# Altium schematic sheet 2012_fdp_balise_mere.SchDoc
size A2
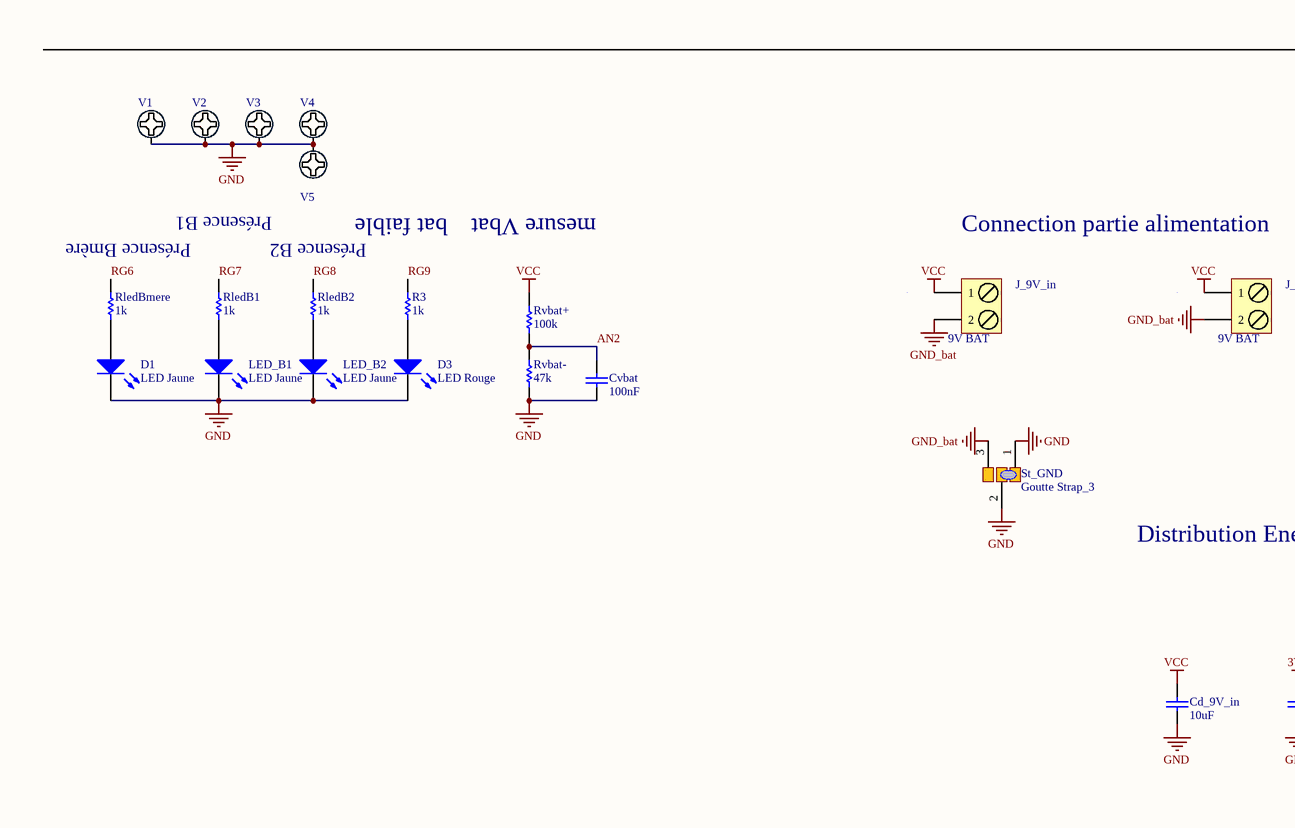
[diagram p0: 2012_fdp_balise_mere.SchDoc, left]
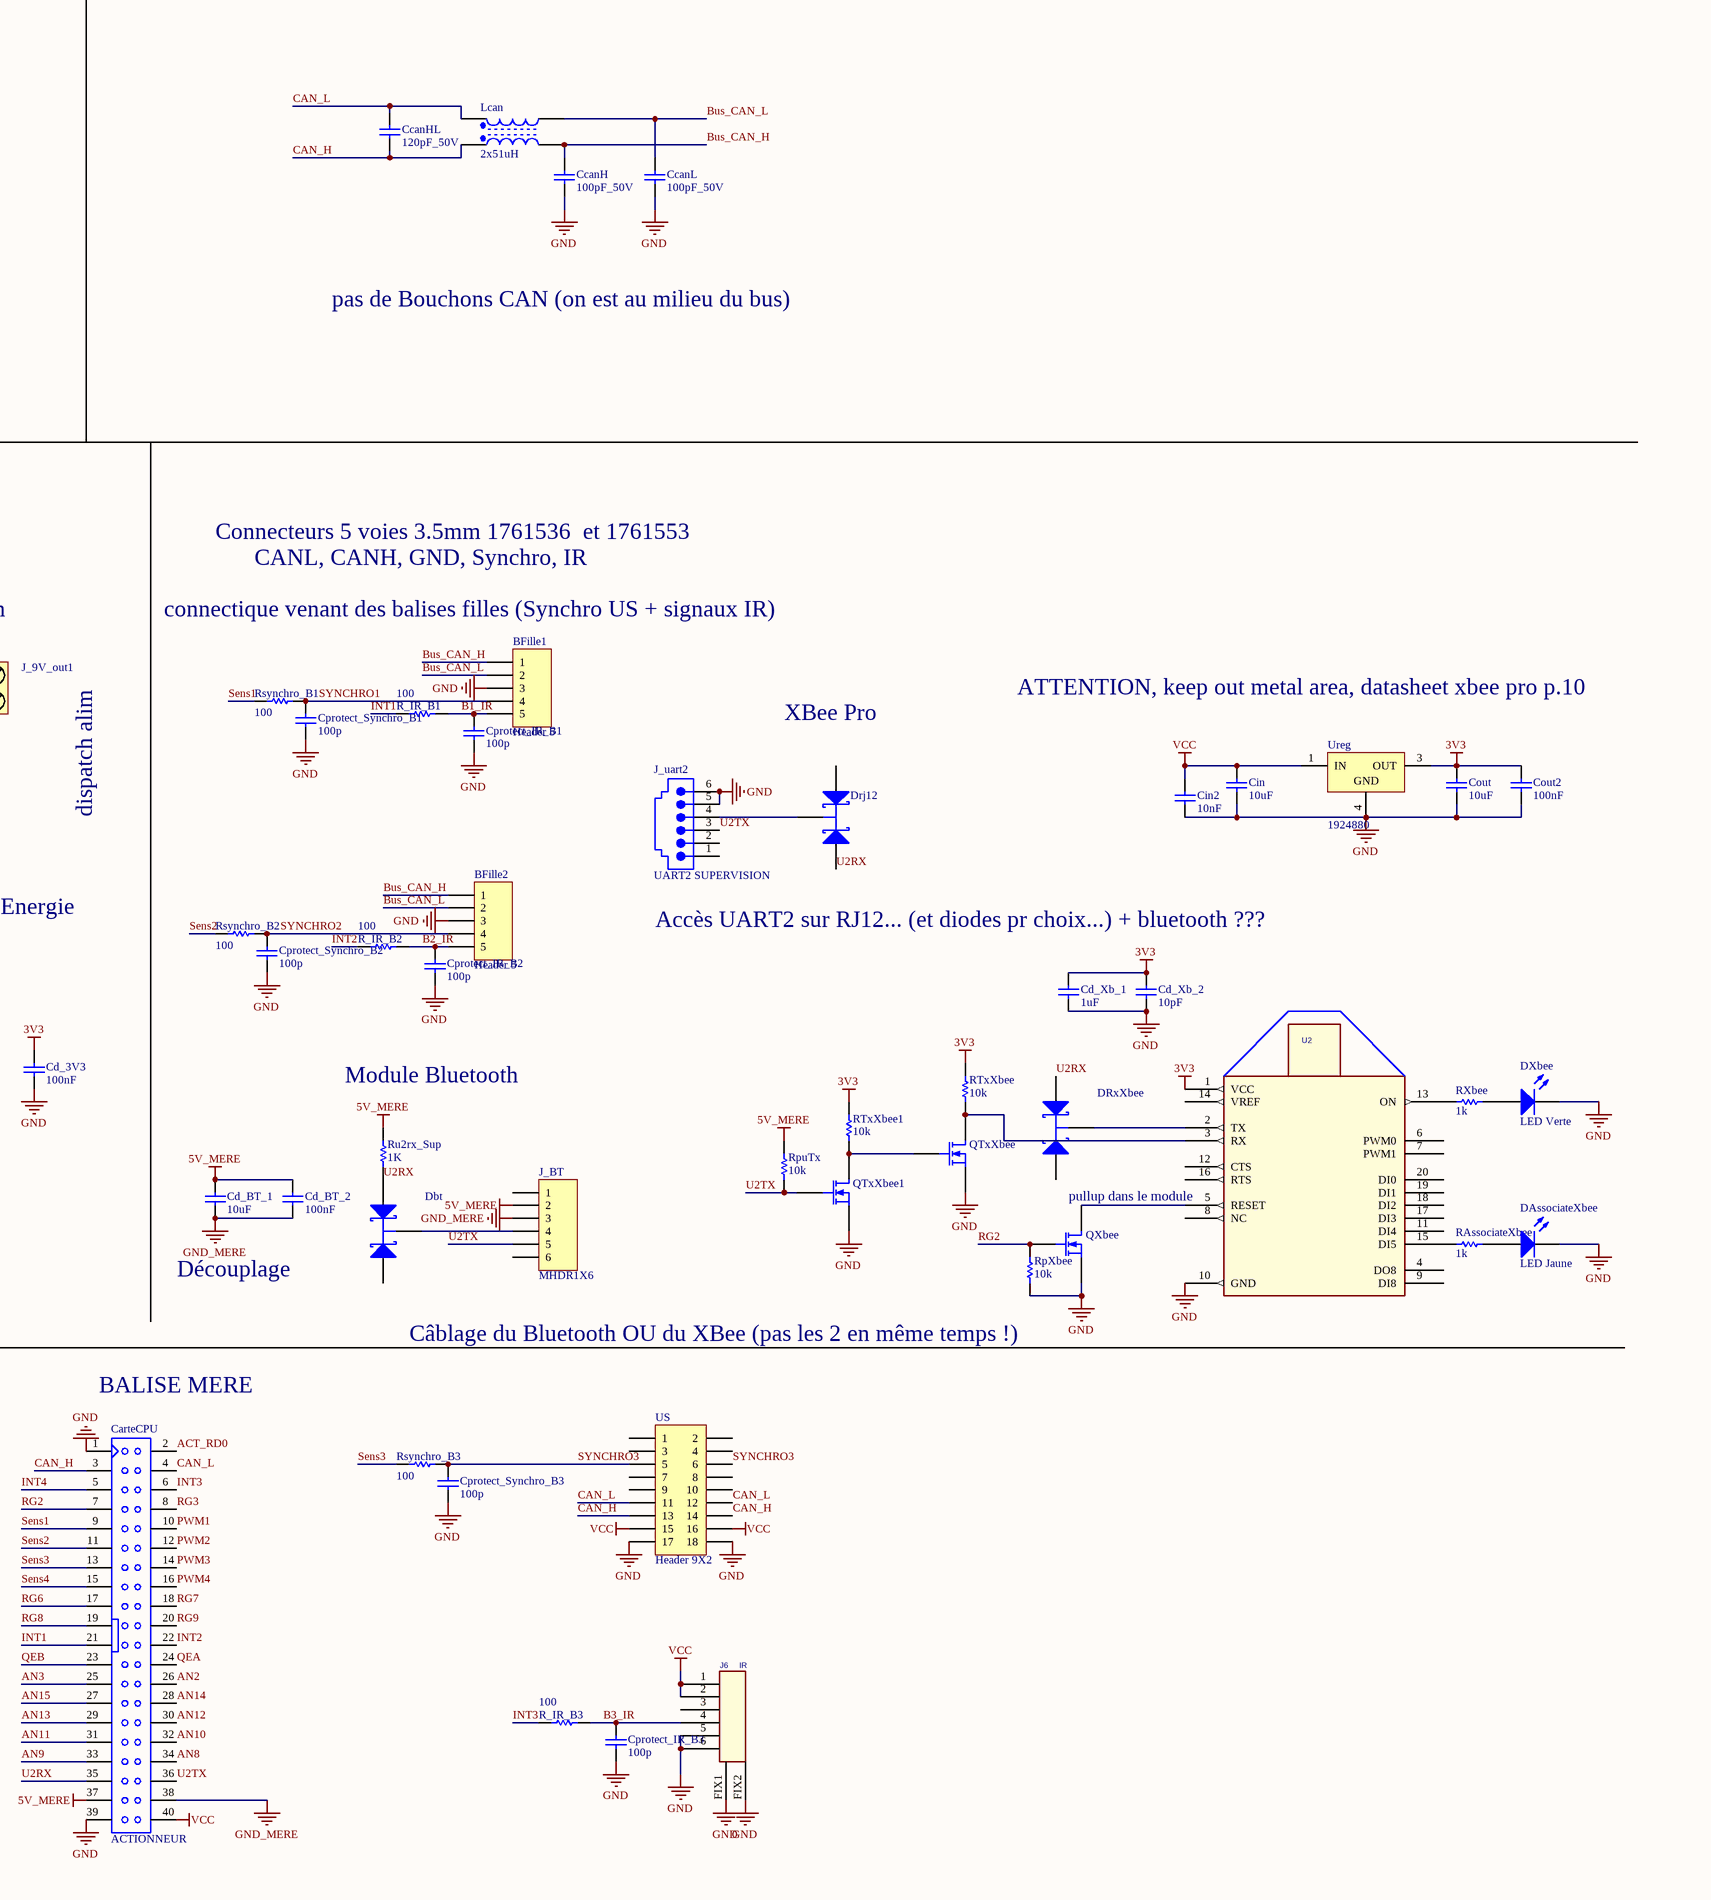
[diagram p1: 2012_fdp_balise_mere.SchDoc, right]

## Parts
BFille1  Header 5  [BORNIER_5V_3.5MM]
BFille2  Header 5  [BORNIER_5V_3.5MM]
CarteCPU  ACTIONNEUR  [HE10/40_MAL_DROIT-FDP-ROBOT]
CcanH  100pF_50V  [C0603_N]
CcanHL  120pF_50V  [C0603_N]
CcanL  100pF_50V  [C0603_N]
Cd_3V3  100nF  [C0805_N]
Cd_9V_in  10uF  [C0805_N]
Cd_BT_1  10uF  [C0805_N]
Cd_BT_2  100nF  [C0805_N]
Cd_Xb_1  1uF  [C0805_N]
Cd_Xb_2  10pF  [C0805_N]
Cin  10uF  [C1206_N]
Cin2  10nF  [C0805_N]
Cout  10uF  [C1206_N]
Cout2  100nF  [C0805_N]
Cprotect_IR_B1  100p  [C0805_N]
Cprotect_IR_B2  100p  [C0805_N]
Cprotect_IR_B3  100p  [C0805_N]
Cprotect_Synchro_B1  100p  [C0805_N]
Cprotect_Synchro_B2  100p  [C0805_N]
Cprotect_Synchro_B3  100p  [C0805_N]
Cvbat  100nF  [C0805_N]
D1  LED Jaune  [LED_0805]
D3  LED Rouge  [LED_0805]
DAssociateXbee  LED Jaune  [LED_0805]
Dbt  Diode Shottky double BAT54C  [SOT23-3N]  (value not drawn)
Drj12  Diode Shottky double BAT54C  [SOT23-3N]  (value not drawn)
DRxXbee  Diode Shottky double BAT54C  [SOT23-3N]  (value not drawn)
DXbee  LED Verte  [LED_0805]
J6  IR  [RJ11_6/6 - droit]
J_9V_in  9V BAT  [BORNIER2]
J_9V_out1  9V BAT  [BORNIER2]
J_BT  MHDR1X6  [HE14_6]
J_uart2  UART2 SUPERVISION  [RJ11_6/6]
Lcan  2x51uH  [Self de mode commun Wurth Elektronik WE-SL2]
LED_B1  LED Jaune  [LED_0805]
LED_B2  LED Jaune  [LED_0805]
QTxXbee  Transistor MOSFET-N  [SOT23-3N]  (value not drawn)
QTxXbee1  Transistor MOSFET-N  [SOT23-3N]  (value not drawn)
QXbee  Transistor MOSFET-N  [SOT23-3N]  (value not drawn)
R3  1k  [R1206_N]
R_IR_B1  100  [R1206_N]
R_IR_B2  100  [R1206_N]
R_IR_B3  100  [R1206_N]
RAssociateXbee  1k  [R1206_N]
RledB1  1k  [R1206_N]
RledB2  1k  [R1206_N]
RledBmere  1k  [R1206_N]
RpuTx  10k  [R1206_N]
RpXbee  10k  [R1206_N]
Rsynchro_B1  100  [R1206_N]
Rsynchro_B2  100  [R1206_N]
Rsynchro_B3  100  [R1206_N]
RTxXbee  10k  [R1206_N]
RTxXbee1  10k  [R1206_N]
Ru2rx_Sup  1K  [R1206_N]
Rvbat+  100k  [R1206_N]
Rvbat-  47k  [R1206_N]
RXbee  1k  [R1206_N]
St_GND  Goutte Strap_3  [Goutte Strap_3]
U2  XBee  [MODULE_XBEE]  (value not drawn)
Ureg  1924880  [369A-13]
US  Header 9X2  [HDR2X9]
V1  Pad_M3  [M3x6mm]  (value not drawn)
V2  Pad_M3  [M3x6mm]  (value not drawn)
V3  Pad_M3  [M3x6mm]  (value not drawn)
V4  Pad_M3  [M3x6mm]  (value not drawn)
V5  Pad_M3  [M3x6mm]  (value not drawn)

## Nets
3V3: Cd_3V3.2 Cd_Xb_1.2 Cd_Xb_2.2 Cout.2 Cout2.2 RTxXbee.1 RTxXbee1.1 U2.1(VCC) Ureg.3(OUT)
5V_MERE: CarteCPU.37 Cd_BT_1.2 Cd_BT_2.2 J_BT.2 RpuTx.1 Ru2rx_Sup.2
GND: BFille1.3 BFille2.3 CarteCPU.1 CarteCPU.39 CcanH.1 CcanL.1 Cd_3V3.1 Cd_9V_in.1 Cd_Xb_1.1 Cd_Xb_2.1 Cin.1 Cin2.1 Cout.1 Cout2.1 Cprotect_IR_B1.2 Cprotect_IR_B2.2 Cprotect_IR_B3.2 Cprotect_Synchro_B1.2 Cprotect_Synchro_B2.2 Cprotect_Synchro_B3.2 Cvbat.2 D1.2(K) D3.2(K) DAssociateXbee.2(K) DXbee.2(K) J6.5 J6.6 J6.FIX1 J6.FIX2 J_uart2.5 J_uart2.6 LED_B1.2(K) LED_B2.2(K) QTxXbee.3(S) QTxXbee1.3(S) QXbee.3(S) RpXbee.2 Rvbat-.2 St_GND.1 St_GND.2 U2.10(GND) Ureg.4(GND) US.17 US.18 V1.1 V2.1 V3.1 V4.1 V5.1
GND_bat: J_9V_in.2 J_9V_out1.2 St_GND.3
GND_MERE: CarteCPU.38 Cd_BT_1.1 Cd_BT_2.1 J_BT.3
VCC: CarteCPU.40 Cd_9V_in.2 Cin.2 Cin2.2 J6.1 J6.2 J_9V_in.1 J_9V_out1.1 Rvbat+.1 Ureg.1(IN) US.15 US.16
ACT_RD0: CarteCPU.2
AN2: CarteCPU.26 Cvbat.1 Rvbat+.2 Rvbat-.1
AN3: CarteCPU.25
AN8: CarteCPU.34
AN9: CarteCPU.33
AN10: CarteCPU.32
AN11: CarteCPU.31
AN12: CarteCPU.30
AN13: CarteCPU.29
AN14: CarteCPU.28
AN15: CarteCPU.27
B1_IR: BFille1.5 Cprotect_IR_B1.1 R_IR_B1.2
B2_IR: BFille2.5 Cprotect_IR_B2.1 R_IR_B2.2
B3_IR: Cprotect_IR_B3.1 J6.4 R_IR_B3.2
Bus_CAN_H: BFille1.1 BFille2.1 CcanH.2 Lcan.4
Bus_CAN_L: BFille1.2 BFille2.2 CcanL.2 Lcan.3
CAN_H: CarteCPU.3 CcanHL.1 Lcan.1 US.13 US.14
CAN_L: CarteCPU.4 CcanHL.2 Lcan.2 US.11 US.12
INT1: CarteCPU.21 R_IR_B1.1
INT2: CarteCPU.22 R_IR_B2.1
INT3: CarteCPU.6 R_IR_B3.1
INT4: CarteCPU.5
PWM1: CarteCPU.10
PWM2: CarteCPU.12
PWM3: CarteCPU.14
PWM4: CarteCPU.16
QEA: CarteCPU.24
QEB: CarteCPU.23
RG2: CarteCPU.7 QXbee.2(G) RpXbee.1
RG3: CarteCPU.8
RG6: CarteCPU.17 RledBmere.1
RG7: CarteCPU.18 RledB1.2
RG8: CarteCPU.19 RledB2.2
RG9: CarteCPU.20 R3.1
Sens1: CarteCPU.9 Rsynchro_B1.1
Sens2: CarteCPU.11 Rsynchro_B2.1
Sens3: CarteCPU.13 Rsynchro_B3.1
Sens4: CarteCPU.15
SYNCHRO1: BFille1.4 Cprotect_Synchro_B1.1 Rsynchro_B1.2
SYNCHRO2: BFille2.4 Cprotect_Synchro_B2.1 Rsynchro_B2.2
SYNCHRO3: Cprotect_Synchro_B3.1 Rsynchro_B3.2 US.5 US.6
U2RX: CarteCPU.35 Dbt.1(A1) Drj12.1(A1) DRxXbee.1(A1) Ru2rx_Sup.1
U2TX: CarteCPU.36 J_BT.5 J_uart2.3 QTxXbee1.2(G) RpuTx.2
NetD1_1: D1.1(A) RledBmere.2
NetD3_1: D3.1(A) R3.2
NetDAssociateXbee_1: DAssociateXbee.1(A) RAssociateXbee.2
NetDbt_3: Dbt.3(K) J_BT.4
NetDrj12_3: Drj12.3(K) J_uart2.4
NetDRxXbee_3: DRxXbee.3(K) U2.2(TX)
NetDXbee_1: DXbee.1(A) RXbee.2
NetLED_B1_1: LED_B1.1(A) RledB1.1
NetLED_B2_1: LED_B2.1(A) RledB2.1
NetQTxXbee_1: QTxXbee.1(D) RTxXbee.2 U2.3(RX)
NetQTxXbee_2: QTxXbee.2(G) QTxXbee1.1(D) RTxXbee1.2
NetQXbee_1: QXbee.1(D) U2.5(RESET)
NetRAssociateXbee_1: RAssociateXbee.1 U2.15(DI5)
NetRXbee_1: RXbee.1 U2.13(ON)

Not connected (* = marked no-connect by the designer): Dbt 2(A2); Drj12 2(A2); DRxXbee 2(A2); J6 3; J_BT 1 6; J_uart2 1 2; U2 4(DO8) 6(PWM0) 7(PWM1) 8(NC) 9(DI8) 11(DI4) 12(CTS) 14(VREF) 16(RTS) 17(DI3) 18(DI2) 19(DI1) 20(DI0); US 1 2 3 4 7 8 9 10

## Notes on the sheet
- pas de Bouchons CAN (on est au milieu du bus)
- Présence B1
- bat faible
- mesure Vbat
- Connecteurs 5 voies 3.5mm 1761536  et 1761553
- CANL, CANH, GND, Synchro, IR
- Présence Bmère
- Présence B2
- Connection partie alimentation
- (near BFille1) connectique venant des balises filles (Synchro US + signaux IR)
- XBee Pro
- ATTENTION, keep out metal area, datasheet xbee pro p.10
- dispatch alim
- Distribution Energie
- Accès UART2 sur RJ12... (et diodes pr choix...) + bluetooth ???
- Module Bluetooth
- (near U2) pullup dans le module
- Découplage
- (near RpXbee) Câblage du Bluetooth OU du XBee (pas les 2 en même temps !)
- BALISE MERE

## Library data of the parts
BFille1 BFille2 = Header 5: Header, 5-Pin; LatestRevisionDate: 17-Jul-2002; LatestRevisionNote: Re-released for DXP Platform.; Publisher: Altium Limited
CarteCPU = HE10/40: Connector; HE10; 40 Position; Male
CcanH CcanL = Capacitor: FAR: 722080; Published: 8-Jun-2000; LatestRevisionDate: 17-Jul-2002; LatestRevisionNote: Re-released for DXP Platform.; PackageReference: RAD-0.3; Publisher: Altium Limited
CcanHL = Capacitor: FAR: 722042; Published: 8-Jun-2000; LatestRevisionDate: 17-Jul-2002; LatestRevisionNote: Re-released for DXP Platform.; PackageReference: RAD-0.3; Publisher: Altium Limited
Cd_3V3 Cd_9V_in Cd_BT_1 Cd_BT_2 Cd_Xb_1 Cd_Xb_2 = Condensateur: Capacitor; Published: 8-Jun-2000; LatestRevisionDate: 17-Jul-2002; LatestRevisionNote: Re-released for DXP Platform.; PackageReference: RAD-0.3; Publisher: Altium Limited
Cin Cin2 Cout Cout2 Cprotect_IR_B1-Cprotect_IR_B3 Cprotect_Synchro_B1-Cprotect_Synchro_B3 Cvbat = Capacitor: Published: 8-Jun-2000; LatestRevisionDate: 17-Jul-2002; LatestRevisionNote: Re-released for DXP Platform.; PackageReference: RAD-0.3; Publisher: Altium Limited
D1 D3 DAssociateXbee DXbee LED_B1 LED_B2 = LED: Typical LED; Published: 8-Jun-2000; LatestRevisionDate: 08-Jul-2005; LatestRevisionNote: Mech Layer 1 removed.; PackageReference: LED-1; Publisher: Altium Limited
Dbt Drj12 DRxXbee = Diode Shottky double BAT54C: DIODE SCHOTTKY DOUBLE; Manufacturer: ZETEX; Diode Case Style: SOT-23; Description: ZETEX - BAT54C - DIODE SCHOTTKY DOUBLE; Supplier Part Number: 9526501; Supplier: Farnell; ComponentLink1URL: http://www.farnell.com/datasheets/27632.pdf; ComponentLink1Description: http://www.farnell.com/datasheets/27632.pdf; Pricing: 5=0,32, 25=0,23, 100=0,198, 1000=0,154 (EUR); RoHS: YES; Manufacturer Part Number: BAT54C
J6 = CONNECTEUR_RJ12
J_9V_in J_9V_out1 = BORNIER2: Terminal blocks, 2 pins, pitch=5mm
J_BT = MHDR1X6: Header, 6-Pin; LatestRevisionDate: 17-Jul-2002; LatestRevisionNote: Re-released for DXP Platform.; Publisher: Altium Limited
J_uart2 = RJ11_6/6: Right Angle, Standard Profile, Offset Latch DECconnect, Flangeless PCB Jack; Ports: 1; Positions/Loaded: Port1 - 6 Offset Latch/6; PerformanceCategory: 3; PCB_Mounting: Thru-Hole; DrillSize: Nominal, Rounded to nearest 0.05mm; PCB_Layout: Complies with Manufacturer's Recommendation.; Published: 25-Jun-2002; DatasheetDocument: 18-Dec-2001; PackageDocument: 18-Dec-2001; PackageReference: 15-43-6110; Publisher: Altium Limited; ComponentLink1Description: Manufacturer Link; ComponentLink1URL: http://www.molex.com/; ComponentLink2Description: Datasheet; ComponentLink2URL: http://www.molex.com/cmc_upload/common_files/1212003_41369catalogpage.pdf
Lcan = Self de mode commun WE-744220: Self de mode commun, Wurth Elektronik, WE-SL2; Manufacturer Part Number: WE-SL2 744 227; Inductance: 4.7; DC Current Rating: 500; Max DC Resistance: 0.75; Core Material: Ferrite; Inductor Case Style: 74422; Tolérance d'inductance: ± 50%; Description: WUERTH ELEKTRONIK - WE-SL2 744 227 - FILTRE DE LIGNE MODE COMMUN CMS 2X51uH; FAR: 1636267; RoHS: YES; Série: WE-SL2; Category: Composants passifs; ComponentLink1URL: http://www.farnell.com/datasheets/70375.pdf; ComponentLink1Description: http://www.farnell.com/datasheets/70375.pdf; Pricing: 1=2,1, 10=1,95, 50=1,8, 100=1,69, 250=1,59 (EUR); Manufacturer: WURTH ELEKTRONIK
QTxXbee QTxXbee1 QXbee = Transistor MOSFET-N: N-Channel MOSFET; PackageDocument: 1995/1996; Published: 8-Jun-2000; LatestRevisionDate: 17-Jul-2002; LatestRevisionNote: Re-released for DXP Platform.; PackageReference: E3; Publisher: Altium Limited
R3 R_IR_B1-R_IR_B3 RAssociateXbee RledB1 RledB2 RledBmere RpuTx RpXbee Rsynchro_B1-Rsynchro_B3 RTxXbee RTxXbee1 Ru2rx_Sup Rvbat+ Rvbat- RXbee = Resistor: Published: 8-Jun-2000; LatestRevisionDate: 17-Jul-2002; LatestRevisionNote: Re-released for DXP Platform.; PackageReference: AXIAL-0.5; Publisher: Altium Limited
Ureg = MC7805ACD2T: Three-Terminal Positive Voltage Regulator; Note: Pin 2 is electrically connected to Pin 4; Pin 2 is trimmed and not drawn;; Published: 15-Apr-2002; DatasheetVersion: 1997; PackageVersion: 1997; PackageReference: 936-03; Publisher: Altium Limited; PackageDescription: D2-PAK/TO-263-AB; 3 Leads (1 Cropped); Body 14.7 (inc. leads) x 10.2 mm (LxW max); ComponentLink1Description: Manufacturer Link; ComponentLink1URL: http://www.onsemi.com/site/products/taxonomy/0,4438,503,00.html; ComponentLink2Description: Datasheet; ComponentLink2URL: http://www.onsemi.com/pub/Collateral/MC7800-D.PDF
US = Header 9X2: Header, 9-Pin, Dual row; LatestRevisionDate: 17-Jul-2002; LatestRevisionNote: Re-released for DXP Platform.; Publisher: Altium Limited
V1-V5 = Vis M3 X 6mm _TORX_Tête 6mm: Publisher: Damien Guitton
St_GND = Goutte Strap_3: LatestRevisionDate: 25/11/09; Publisher: Damien Guitton